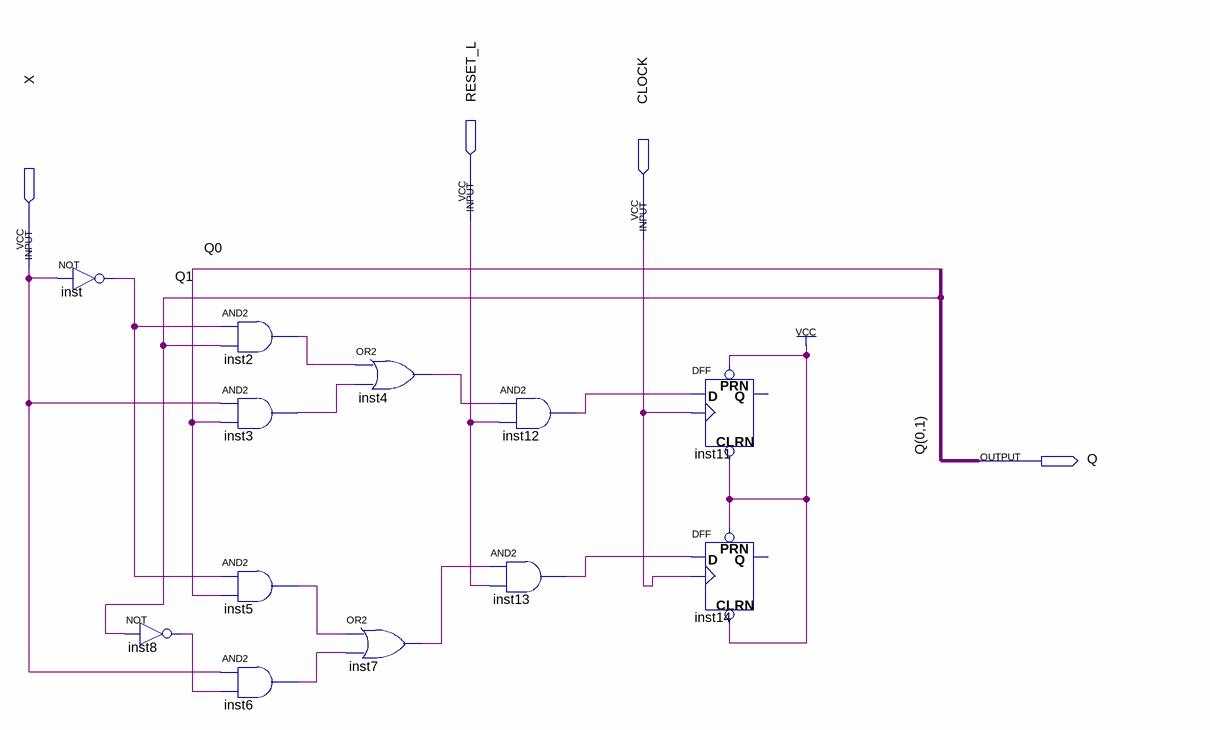
[diagram p0: schematic sheet]
// Quartus schematic ISDSim2.bdf as structural Verilog: 12 symbols, 4 pins
module ISDSim2 (
  input  RESET_L,
  input  CLOCK,
  input  X,
  output Q
);

  wire inst2_out, inst3_out, inst4_out, inst5_out, inst6_out, inst7_out, inst8_out, inst12_out, inst13_out,
       inst_out, Q0, Q1;

  not inst (inst_out, X);
  not inst8 (inst8_out, Q1);
  and inst2 (inst2_out, inst_out, Q1);
  and inst3 (inst3_out, X, Q0);
  and inst5 (inst5_out, inst_out, Q0);
  and inst6 (inst6_out, X, inst8_out);
  or inst4 (inst4_out, inst2_out, inst3_out);
  or inst7 (inst7_out, inst5_out, inst6_out);
  and inst12 (inst12_out, inst4_out, RESET_L);
  and inst13 (inst13_out, inst7_out, RESET_L);
  DFF inst11 (.CLRN(1'b1), .CLK(CLOCK), .D(inst12_out), .PRN(1'b1));  // open: Q
  DFF inst14 (.CLRN(1'b1), .CLK(CLOCK), .D(inst13_out), .PRN(1'b1));  // open: Q
endmodule
